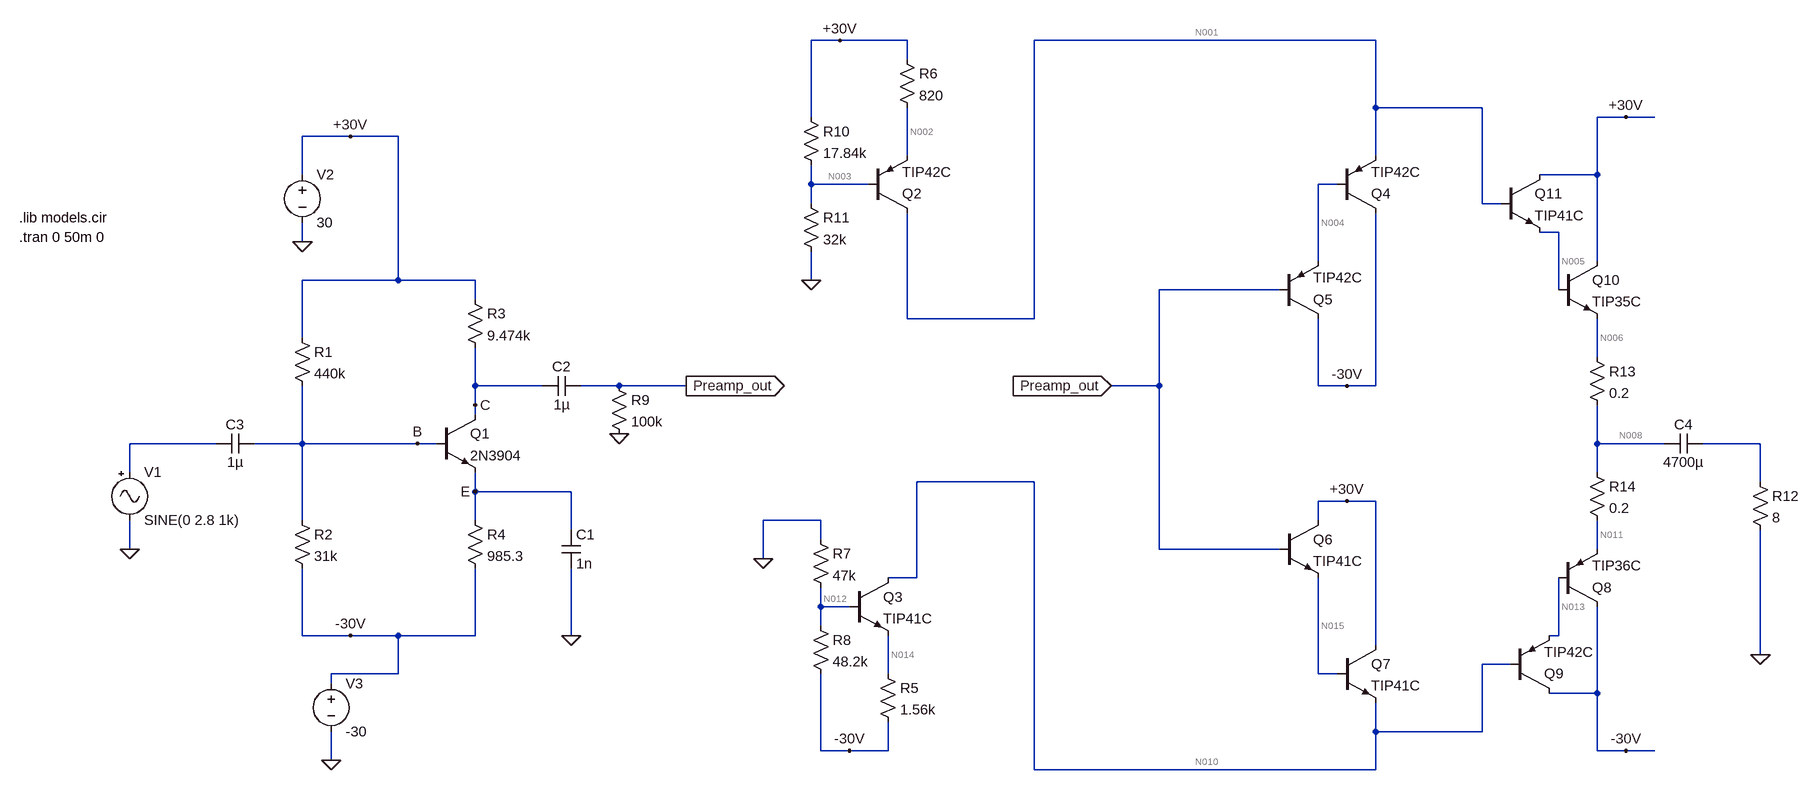
[diagram p0: schematic Preamp + Poweramp.asc]
Preamp + Poweramp.asc, the LTspice schematic file:
Version 4
SHEET 1 3460 2036
WIRE 1136 -176 1088 -176
WIRE 1248 -176 1136 -176
WIRE 2224 -176 1648 -176
WIRE 1248 -144 1248 -176
WIRE 2224 -64 2224 -176
WIRE 2576 -64 2224 -64
WIRE 1088 -48 1088 -176
WIRE 2816 -48 2768 -48
WIRE 2864 -48 2816 -48
WIRE 320 -16 240 -16
WIRE 400 -16 320 -16
WIRE 1248 16 1248 -64
WIRE 2224 16 2224 -64
WIRE 240 48 240 -16
WIRE 2768 48 2768 -48
WIRE 2768 48 2672 48
WIRE 1088 64 1088 32
WIRE 1184 64 1088 64
WIRE 2160 64 2128 64
WIRE 1088 96 1088 64
WIRE 2576 96 2576 -64
WIRE 2608 96 2576 96
WIRE 2704 144 2672 144
WIRE 240 160 240 128
WIRE 2128 192 2128 64
WIRE 2768 192 2768 48
WIRE 400 224 400 -16
WIRE 400 224 240 224
WIRE 528 224 400 224
WIRE 1088 224 1088 176
WIRE 2064 240 1856 240
WIRE 2704 240 2704 144
WIRE 528 256 528 224
WIRE 1248 288 1248 112
WIRE 1648 288 1648 -176
WIRE 1648 288 1248 288
WIRE 240 320 240 224
WIRE 2768 352 2768 288
WIRE 528 400 528 336
WIRE 640 400 528 400
WIRE 768 400 704 400
WIRE 880 400 768 400
WIRE 1856 400 1856 240
WIRE 1856 400 1776 400
WIRE 2128 400 2128 288
WIRE 2176 400 2128 400
WIRE 2224 400 2224 112
WIRE 2224 400 2176 400
WIRE 528 432 528 400
WIRE 528 448 528 432
WIRE 96 496 -48 496
WIRE 240 496 240 400
WIRE 240 496 160 496
WIRE 432 496 240 496
WIRE 464 496 432 496
WIRE 2768 496 2768 432
WIRE 2880 496 2768 496
WIRE 3040 496 2944 496
WIRE -48 544 -48 496
WIRE 2768 544 2768 496
WIRE 1648 560 1264 560
WIRE 3040 560 3040 496
WIRE 528 576 528 544
WIRE 688 576 528 576
WIRE 2176 592 2128 592
WIRE 2224 592 2176 592
WIRE 240 624 240 496
WIRE 528 624 528 576
WIRE 1104 624 1008 624
WIRE 2128 624 2128 592
WIRE 688 640 688 576
WIRE 1104 656 1104 624
WIRE -48 672 -48 624
WIRE 1856 672 1856 400
WIRE 2064 672 1856 672
WIRE 2768 672 2768 624
WIRE 1008 688 1008 624
WIRE 1264 720 1264 560
WIRE 1264 720 1216 720
WIRE 1104 768 1104 736
WIRE 1152 768 1104 768
WIRE 1104 800 1104 768
WIRE 240 816 240 704
WIRE 320 816 240 816
WIRE 400 816 320 816
WIRE 528 816 528 704
WIRE 528 816 400 816
WIRE 688 816 688 704
WIRE 2704 816 2704 720
WIRE 2704 816 2688 816
WIRE 2224 832 2224 592
WIRE 3040 848 3040 640
WIRE 2624 864 2576 864
WIRE 400 880 400 816
WIRE 400 880 288 880
WIRE 1216 880 1216 816
WIRE 2128 880 2128 720
WIRE 2160 880 2128 880
WIRE 288 896 288 880
WIRE 2768 912 2768 768
WIRE 2768 912 2688 912
WIRE 2224 976 2224 928
WIRE 2576 976 2576 864
WIRE 2576 976 2224 976
WIRE 1104 1008 1104 880
WIRE 1152 1008 1104 1008
WIRE 1216 1008 1216 960
WIRE 1216 1008 1152 1008
WIRE 2768 1008 2768 912
WIRE 2816 1008 2768 1008
WIRE 2864 1008 2816 1008
WIRE 288 1024 288 976
WIRE 1648 1040 1648 560
WIRE 2224 1040 2224 976
WIRE 2224 1040 1648 1040
FLAG -48 672 0
FLAG 288 1024 0
FLAG 240 160 0
FLAG 880 400 Preamp_out
IOPIN 880 400 Out
FLAG 432 496 B
FLAG 528 432 C
FLAG 528 576 E
FLAG 688 816 0
FLAG 320 -16 +30V
FLAG 320 816 -30V
FLAG 1776 400 Preamp_out
IOPIN 1776 400 In
FLAG 2176 592 +30V
FLAG 2176 400 -30V
FLAG 3040 848 0
FLAG 2816 -48 +30V
FLAG 2816 1008 -30V
FLAG 1088 224 0
FLAG 1136 -176 +30V
FLAG 1008 688 0
FLAG 1152 1008 -30V
FLAG 768 480 0
SYMBOL npn 464 448 R0
SYMATTR InstName Q1
SYMATTR Value 2N3904
SYMBOL res 224 304 R0
SYMATTR InstName R1
SYMATTR Value 440k
SYMBOL res 224 608 R0
SYMATTR InstName R2
SYMATTR Value 31k
SYMBOL res 512 240 R0
SYMATTR InstName R3
SYMATTR Value 9.474k
SYMBOL res 512 608 R0
SYMATTR InstName R4
SYMATTR Value 985.3
SYMBOL cap 704 384 R90
WINDOW 0 0 32 VBottom 2
WINDOW 3 32 32 VTop 2
SYMATTR InstName C2
SYMATTR Value 1µ
SYMBOL cap 160 480 R90
WINDOW 0 0 32 VBottom 2
WINDOW 3 32 32 VTop 2
SYMATTR InstName C3
SYMATTR Value 1µ
SYMBOL Misc\\signal -48 528 R0
WINDOW 123 0 0 Left 0
WINDOW 39 0 0 Left 0
SYMATTR InstName V1
SYMATTR Value SINE(0 2.8 1k)
SYMBOL voltage 240 32 R0
WINDOW 123 0 0 Left 0
WINDOW 39 0 0 Left 0
SYMATTR InstName V2
SYMATTR Value 30
SYMBOL voltage 288 880 R0
WINDOW 123 0 0 Left 0
WINDOW 39 0 0 Left 0
SYMATTR InstName V3
SYMATTR Value -30
SYMBOL cap 672 640 R0
SYMATTR InstName C1
SYMATTR Value 1n
SYMBOL pnp 2160 112 M180
SYMATTR InstName Q4
SYMATTR Value TIP42C
SYMBOL pnp 2064 288 M180
SYMATTR InstName Q5
SYMATTR Value TIP42C
SYMBOL npn 2064 624 R0
SYMATTR InstName Q6
SYMATTR Value TIP41C
SYMBOL npn 2160 832 R0
SYMATTR InstName Q7
SYMATTR Value TIP41C
SYMBOL cap 2944 480 R90
WINDOW 0 0 32 VBottom 2
WINDOW 3 32 32 VTop 2
SYMATTR InstName C4
SYMATTR Value 4700µ
SYMBOL res 3024 544 R0
SYMATTR InstName R12
SYMATTR Value 8
SYMBOL res 2752 336 R0
SYMATTR InstName R13
SYMATTR Value 0.2
SYMBOL res 2752 528 R0
SYMATTR InstName R14
SYMATTR Value 0.2
SYMBOL pnp 2704 768 M180
SYMATTR InstName Q8
SYMATTR Value TIP36C
SYMBOL pnp 2624 912 M180
SYMATTR InstName Q9
SYMATTR Value TIP42C
SYMBOL npn 2704 192 R0
SYMATTR InstName Q10
SYMATTR Value TIP35C
SYMBOL npn 2608 48 R0
SYMATTR InstName Q11
SYMATTR Value TIP41C
SYMBOL pnp 1184 112 M180
SYMATTR InstName Q2
SYMATTR Value TIP42C
SYMBOL res 1232 -160 R0
SYMATTR InstName R6
SYMATTR Value 820
SYMBOL res 1072 -64 R0
SYMATTR InstName R10
SYMATTR Value 17.84k
SYMBOL res 1072 80 R0
SYMATTR InstName R11
SYMATTR Value 32k
SYMBOL npn 1152 720 R0
SYMATTR InstName Q3
SYMATTR Value TIP41C
SYMBOL res 1200 864 R0
SYMATTR InstName R5
SYMATTR Value 1.56k
SYMBOL res 1088 640 R0
SYMATTR InstName R7
SYMATTR Value 47k
SYMBOL res 1088 784 R0
SYMATTR InstName R8
SYMATTR Value 48.2k
SYMBOL res 752 384 R0
SYMATTR InstName R9
SYMATTR Value 100k
TEXT -232 120 Left 2 !.lib models.cir
TEXT -232 152 Left 2 !.tran 0 50m 0

The netlist it stands for:
* Preamp + Poweramp.asc
Q1 C B E 0 2N3904
R1 +30V B 440k
R2 B -30V 31k
R3 +30V C 9.474k
R4 E -30V 985.3
C2 Preamp_out C 1µ
C3 B N007 1µ
V1 N007 0 SINE(0 2.8 1k)
V2 +30V 0 30
V3 -30V 0 -30
C1 E 0 1n
Q4 -30V N004 N001 0 TIP42C
Q5 -30V Preamp_out N004 0 TIP42C
Q6 +30V Preamp_out N015 0 TIP41C
Q7 +30V N015 N010 0 TIP41C
C4 N009 N008 4700µ
R12 N009 0 8
R13 N006 N008 0.2
R14 N008 N011 0.2
Q8 -30V N013 N011 0 TIP36C
Q9 -30V N010 N013 0 TIP42C
Q10 +30V N005 N006 0 TIP35C
Q11 +30V N001 N005 0 TIP41C
Q2 N001 N003 N002 0 TIP42C
R6 +30V N002 820
R10 +30V N003 17.84k
R11 N003 0 32k
Q3 N010 N012 N014 0 TIP41C
R5 N014 -30V 1.56k
R7 0 N012 47k
R8 N012 -30V 48.2k
R9 Preamp_out 0 100k
.model NPN NPN
.model PNP PNP
.lib standard.bjt
.lib models.cir
.tran 0 50m 0
.backanno
.end

* Results of the author's LTspice run, read from the files saved beside the schematic
* Operating Point, zero values left out:
*   V(c) = 886.4 mV
*   V(b) = -26.29 V
*   V(e) = -26.96 V
*   V(+30v) = 30 V
*   V(-30v) = -30 V
*   V(preamp_out) = -374.9 µV
*   V(n004) = 535.5 mV
*   V(n001) = 1.196 V
*   V(n015) = -476 mV
*   V(n010) = -1.073 V
*   V(n008) = 115.6 mV
*   V(n006) = 117.4 mV
*   V(n011) = 113.9 mV
*   V(n013) = -541.9 mV
*   V(n005) = 717.8 mV
*   V(n003) = 20.35 V
*   V(n002) = 21.02 V
*   V(n012) = -16.87 V
*   V(n014) = -17.48 V
*   Ic(Q10) = 8.736 mA
*   Ib(Q10) = 80.15 µA
*   Ie(Q10) = -8.817 mA
*   Ic(Q8) = -8.744 mA
*   Ib(Q8) = -72.74 µA
*   Ie(Q8) = 8.817 mA
*   Ic(Q3) = 7.941 mA
*   Ib(Q3) = 86.67 µA
*   Ie(Q3) = -8.028 mA
*   Ic(Q11) = 78.49 µA
*   Ib(Q11) = 1.657 µA
*   Ie(Q11) = -80.15 µA
*   Ic(Q7) = 7.868 mA
*   Ib(Q7) = 72.33 µA
*   Ie(Q7) = -7.94 mA
*   Ic(Q6) = 70.82 µA
*   Ib(Q6) = 1.508 µA
*   Ie(Q6) = -72.33 µA
*   Ic(Q2) = -10.86 mA
*   Ib(Q2) = -95.34 µA
*   Ie(Q2) = 10.95 mA
*   Ic(Q9) = -71.42 µA
*   Ib(Q9) = -1.315 µA
*   Ie(Q9) = 72.74 µA
*   Ic(Q5) = -85.62 µA
*   Ib(Q5) = -1.505 µA
*   Ie(Q5) = 87.13 µA
*   Ic(Q4) = -10.77 mA
*   Ib(Q4) = -87.13 µA
*   Ie(Q4) = 10.86 mA
*   Ic(Q1) = 3.073 mA
*   Ib(Q1) = 8.103 µA
*   Ie(Q1) = -3.081 mA
*   I(R9) = -3.749 nA
*   I(R8) = 272.3 µA
*   I(R7) = 359 µA
*   I(R5) = 8.028 mA
*   I(R11) = 636.1 µA
*   I(R10) = 540.7 µA
*   I(R6) = 10.95 mA
*   I(R14) = 8.817 mA
*   I(R13) = 8.817 mA
*   I(R4) = 3.081 mA
*   I(R3) = 3.073 mA
*   I(R2) = 119.8 µA
*   I(R1) = 127.9 µA
*   I(V3) = 31.17 mA
*   I(V2) = -31.45 mA
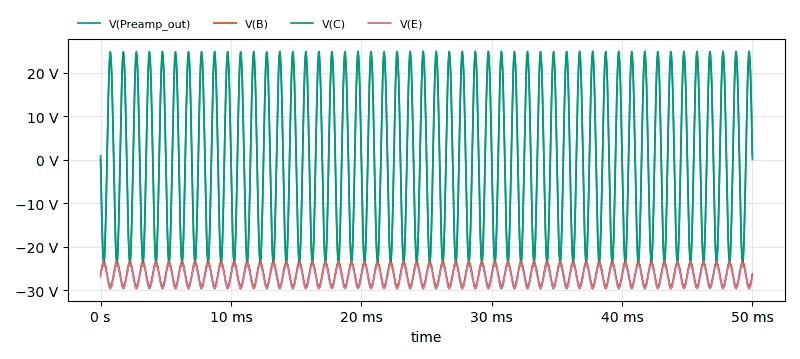
[diagram p1: Transient Analysis of Preamp + Poweramp.asc, plotted from the saved traces]
* Transient Analysis, 1 run:
*   V(Preamp_out): min -24.04 V, max 24.08 V, average 132.1 mV, rms 17.01 V, last 65.42 mV
*   V(B): min -29.11 V, max -23.51 V, average -26.31 V, rms 26.38 V, last -26.3 V
*   V(C): min -23.2 V, max 24.99 V, average 1.015 V, rms 17.05 V, last 1.023 V
*   V(E): min -29.72 V, max -24.21 V, average -26.98 V, rms 27.05 V, last -26.97 V